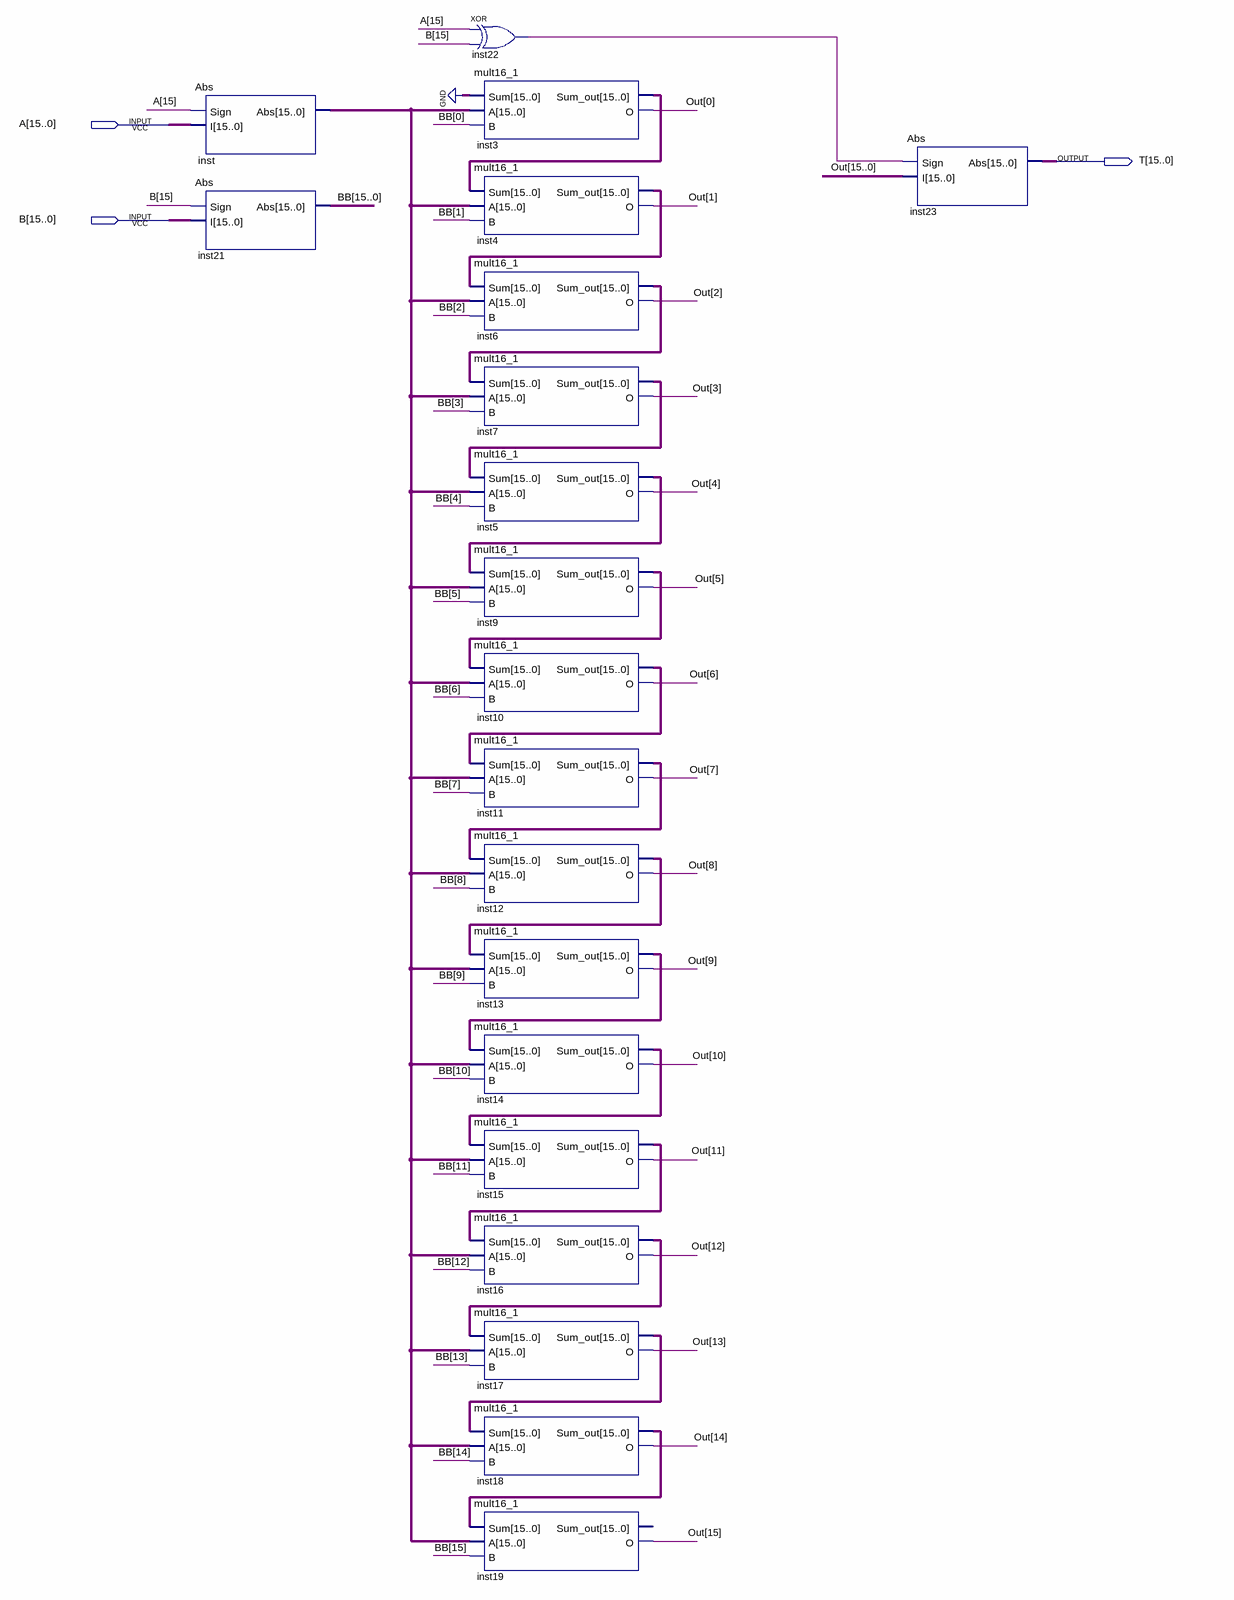
[diagram p0: schematic sheet]
// Quartus schematic mult16.bdf as structural Verilog: 20 symbols, 3 pins
module mult16 (
  input  [15:0] A,
  input  [15:0] B,
  output [15:0] T
);

  wire inst22_out;
  wire [15:0] BB, inst3_sum_out, inst4_sum_out, inst5_sum_out, inst6_sum_out, inst7_sum_out, inst9_sum_out,
       inst10_sum_out, inst11_sum_out, inst12_sum_out, inst13_sum_out, inst14_sum_out, inst15_sum_out,
       inst16_sum_out, inst17_sum_out, inst18_sum_out, inst_abs, Out;

  Abs inst (.Sign(A[15]), .I(A), .Abs(inst_abs));
  Abs inst21 (.Sign(B[15]), .I(B), .Abs(BB));
  xor inst22 (inst22_out, A[15], B[15]);
  mult16_1 inst3 (.Sum({16{1'b0}}), .A(inst_abs), .B(BB[0]), .Sum_out(inst3_sum_out), .O(Out[0]));
  mult16_1 inst4 (.Sum(inst3_sum_out), .A(inst_abs), .B(BB[1]), .Sum_out(inst4_sum_out), .O(Out[1]));
  mult16_1 inst6 (.Sum(inst4_sum_out), .A(inst_abs), .B(BB[2]), .Sum_out(inst6_sum_out), .O(Out[2]));
  mult16_1 inst7 (.Sum(inst6_sum_out), .A(inst_abs), .B(BB[3]), .Sum_out(inst7_sum_out), .O(Out[3]));
  mult16_1 inst5 (.Sum(inst7_sum_out), .A(inst_abs), .B(BB[4]), .Sum_out(inst5_sum_out), .O(Out[4]));
  mult16_1 inst9 (.Sum(inst5_sum_out), .A(inst_abs), .B(BB[5]), .Sum_out(inst9_sum_out), .O(Out[5]));
  mult16_1 inst10 (.Sum(inst9_sum_out), .A(inst_abs), .B(BB[6]), .Sum_out(inst10_sum_out), .O(Out[6]));
  mult16_1 inst11 (.Sum(inst10_sum_out), .A(inst_abs), .B(BB[7]), .Sum_out(inst11_sum_out), .O(Out[7]));
  mult16_1 inst12 (.Sum(inst11_sum_out), .A(inst_abs), .B(BB[8]), .Sum_out(inst12_sum_out), .O(Out[8]));
  mult16_1 inst13 (.Sum(inst12_sum_out), .A(inst_abs), .B(BB[9]), .Sum_out(inst13_sum_out), .O(Out[9]));
  mult16_1 inst14 (.Sum(inst13_sum_out), .A(inst_abs), .B(BB[10]), .Sum_out(inst14_sum_out), .O(Out[10]));
  mult16_1 inst15 (.Sum(inst14_sum_out), .A(inst_abs), .B(BB[11]), .Sum_out(inst15_sum_out), .O(Out[11]));
  mult16_1 inst16 (.Sum(inst15_sum_out), .A(inst_abs), .B(BB[12]), .Sum_out(inst16_sum_out), .O(Out[12]));
  mult16_1 inst17 (.Sum(inst16_sum_out), .A(inst_abs), .B(BB[13]), .Sum_out(inst17_sum_out), .O(Out[13]));
  mult16_1 inst18 (.Sum(inst17_sum_out), .A(inst_abs), .B(BB[14]), .Sum_out(inst18_sum_out), .O(Out[14]));
  mult16_1 inst19 (.Sum(inst18_sum_out), .A(inst_abs), .B(BB[15]), .O(Out[15]));  // open: Sum_out
  Abs inst23 (.Sign(inst22_out), .I(Out), .Abs(T));
endmodule
